# EAGLE design 1DD-17-test-board-mk-1.1 (EAGLE 6.6.0)
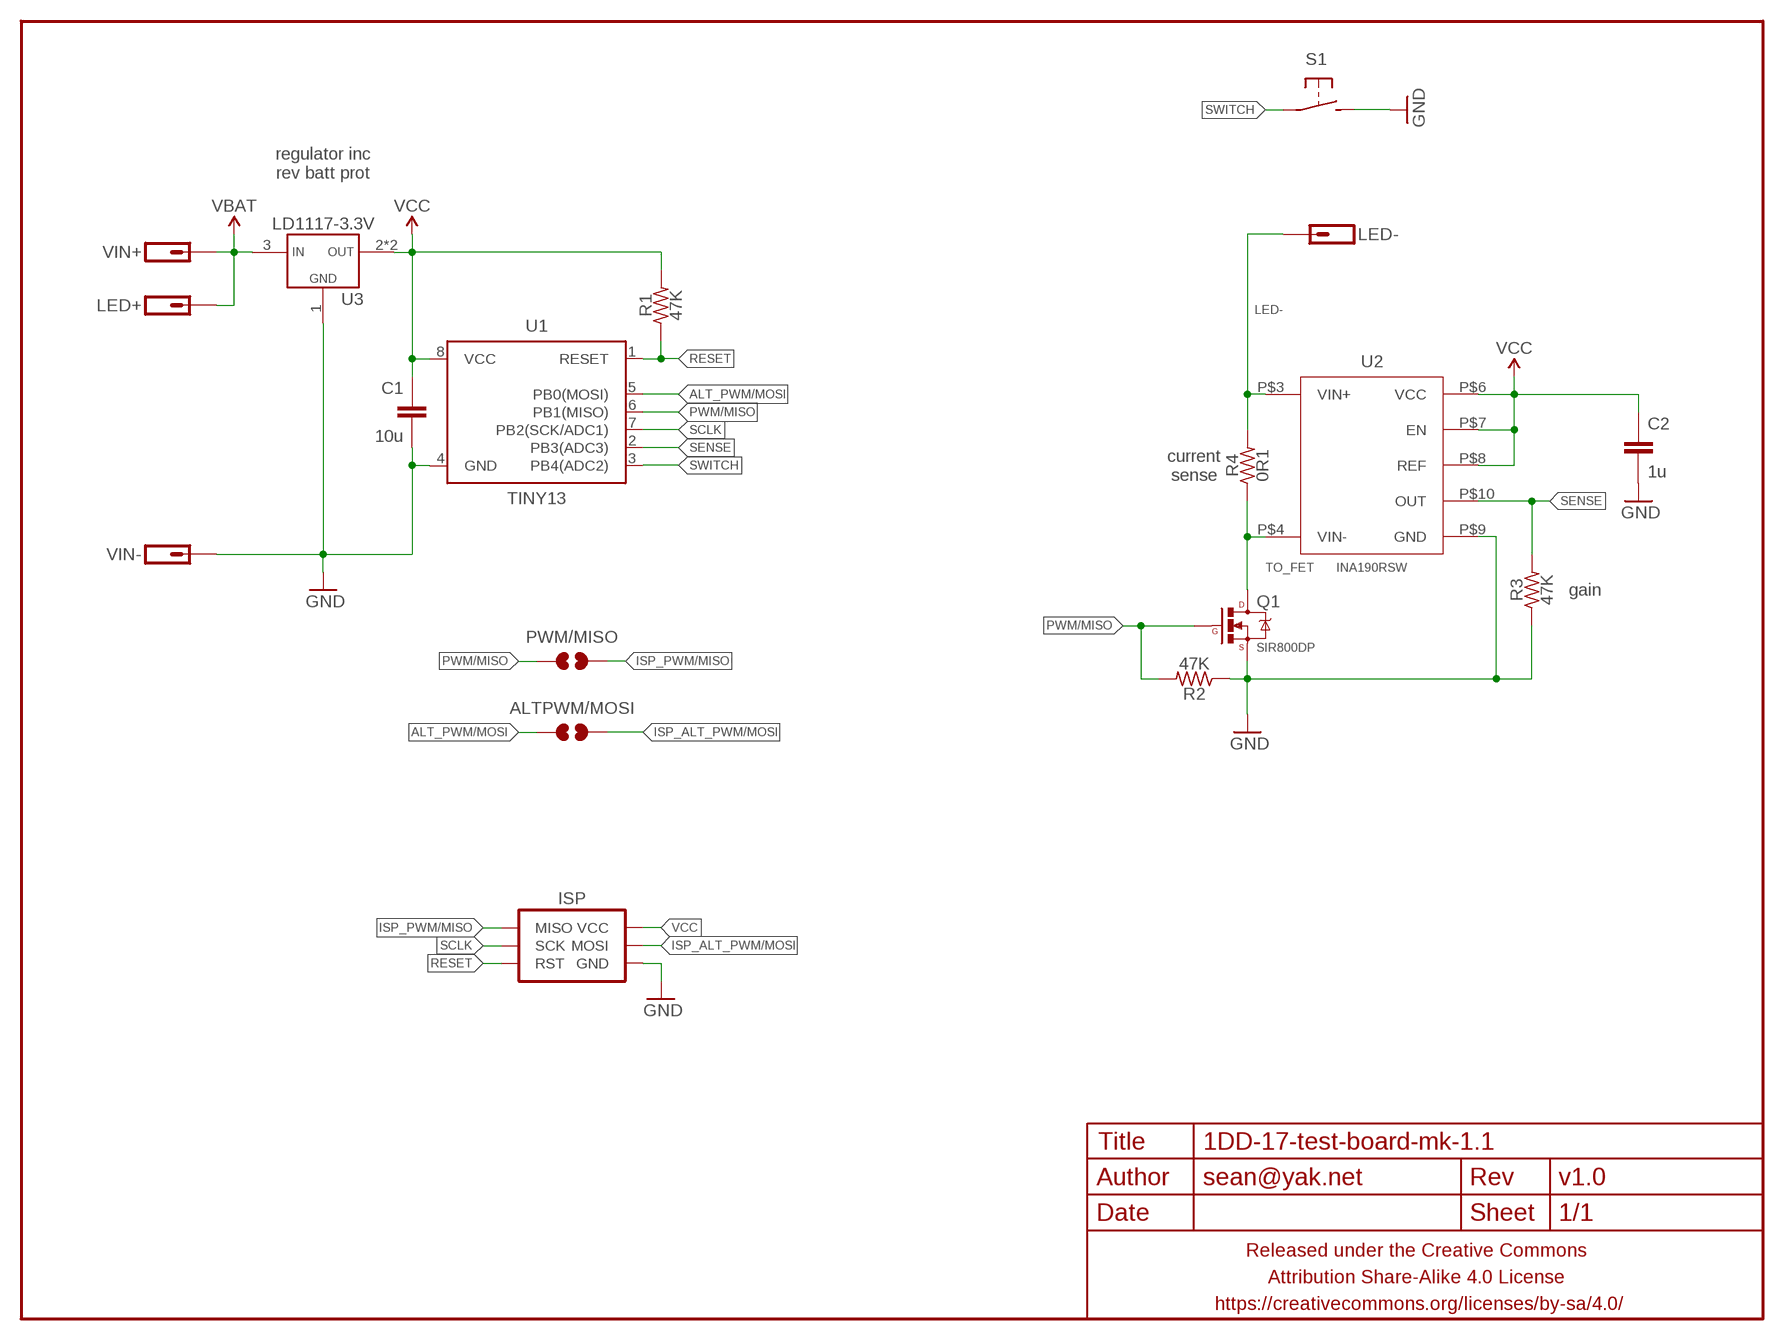
[diagram p0: schematic, sheet 1]

## Parts
ALTPWM/MOSI  JUMPER-PAD-2-NOYES_SILK  [PAD-JUMPER-2-NO_YES_SILK]
C1  10u  CAPACITOR-CERAMICC0805-TIGHTER  [C0805-TIGHTER]
C2  1u  CAPACITOR-CERAMICC0603-TIGHTER  [C0603-TIGHTER]
FRAME1  FRAME-LETTERNO_PACKAGE  [DUMMY]
ISP  AVR_SPI_PRG_6PTH  [2X3]
LED+  M01OFFSET  [1X01_OFFSET]
LED-  M01OFFSET  [1X01_OFFSET]
PWM/MISO  JUMPER-PAD-2-NOYES_SILK  [PAD-JUMPER-2-NO_YES_SILK]
Q1  SIR800DP  MOSFET-NCHANNELPSMN4R0-30YLD  [LFPAK56]
R1  47K  RESISTORR0603-TIGHTER  [R0603-TIGHTER]
R2  47K  RESISTORR0603-TIGHTER  [R0603-TIGHTER]
R3  47K  RESISTORR0603-TIGHTER  [R0603-TIGHTER]
R4  0R1  RESISTORR1206  [R1206]
S1  SPST-NO-TACT3MM-PTH-SMALL-PADS  [DTS-3-SMALL-PADS]
U1  TINY13  ATTINY13SOIC-NARROWER  [SO08-SKINNYPADS]
U2  INA190RSW  [UQFN-10]
U3  LD1117-3.3V  VREG_1117SOT223  [SOT223]
VIN+  M01OFFSET  [1X01_OFFSET]
VIN-  M01OFFSET  [1X01_OFFSET]

## Nets
ALT_PWM/MOSI: ALTPWM/MOSI.1 U1.5(PB0(MOSI))
GND: C1.2 C2.2 ISP.6(GND) Q1.1(S) Q1.2(S) Q1.3(S) R2.1 R3.1 S1.2 U1.4(GND) U3.1(GND) VIN-.1
ISP_ALT_PWM/MOSI: ALTPWM/MOSI.2 ISP.4(MOSI)
ISP_PWM/MISO: ISP.1(MISO) PWM/MISO.2
LED-: LED-.1 R4.2 U2.P$3(VIN+)
PWM/MISO: PWM/MISO.1 Q1.4(G) R2.2 U1.6(PB1(MISO))
RESET: ISP.5(RST) R1.1 U1.1(RESET)
SCLK: ISP.3(SCK) U1.7(PB2(SCK/ADC1))
SENSE: R3.2 U1.2(PB3(ADC3))
SWITCH: S1.1 U1.3(PB4(ADC2))
TO_FET: Q1.MB@1(D) Q1.MB@2(D) R4.1 U2.P$4(VIN-)
VBAT: LED+.1 U3.3(VIN) VIN+.1
VCC: C1.1 C2.1 ISP.2(VCC) R1.2 U1.8(VCC) U2.P$7(EN) U2.P$8(REF) U3.2(VOUT) U3.4(VOUT)
Unconnected: U2.P$6(VCC) U2.P$9(GND) U2.P$10(OUT)

## Notes on the sheet
- regulator inc
  rev batt prot
- current
  sense
- gain

## Library data of the parts
ALTPWM/MOSI PWM/MISO = a_parts:JUMPER-PAD-2-NO
C1 C2 = a_parts:CAPACITOR-CERAMIC: CAPACITOR, European symbol
FRAME1 = a_parts:FRAME-LETTER: Schematic Frame Standard 8.5x11 US Letter frame; DESIGNER: sean@yak.net; VERSION: v1.0
ISP = a_parts:AVR_SPI_PRG_6: AVR ISP 6 Pin This is the reduced ISP connector for AVR programming. Common on Arduino. This footprint will take up less PCB space and can be used with a 10-pin to 6-pin adapter such as SKU: BOB-08508 **Special note about "TEST_POINT" package. The stop mask is on the top side, so if you want your programming test points to be on the bottom of your board, make sure to place this package on the bottom side of the board. This also ensure that the orientation to program from the bottom side will be correct.
LED+ LED- VIN+ VIN- = a_parts:M01: Header 1 Standard 1-pin 0.1" header. Use with straight break away headers (SKU : PRT-00116), right angle break away headers (PRT-00553), swiss pins (PRT-00743), machine pins (PRT-00117), and female headers (PRT-00115).
Q1 = a_parts:MOSFET-NCHANNEL: Common NMOSFET Parts MFG P/N Store ID Prod ID FDD8780 TRANS-09984 SI7820DN TRANS-11055 FDS6630A IC-08089 2N7002PW TRANS-11151 FQP30N06L COM-10213 TRANS-10060 BSS123LT1G TRANS-08345 BSS138 TRANS-00830 BS170 2N7000
R1-R4 = a_parts:RESISTOR: RESISTOR, American symbol
S1 = a_parts:SPST-NO-TACT
U1 = a_parts:ATTINY13: Atmel 8-pin 1kB flash uC
U2 = a_parts:INA190
U3 = a_parts:VREG_1117

## Board
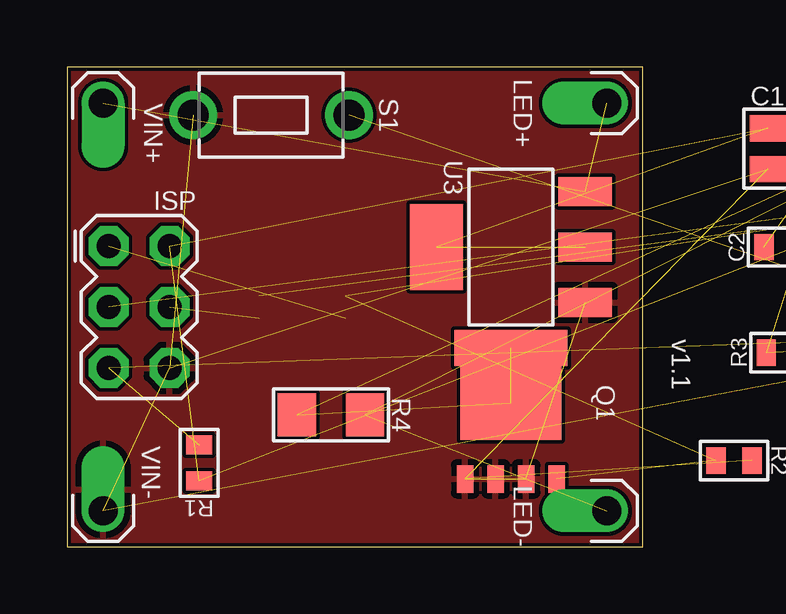
[diagram p1: board, top side]
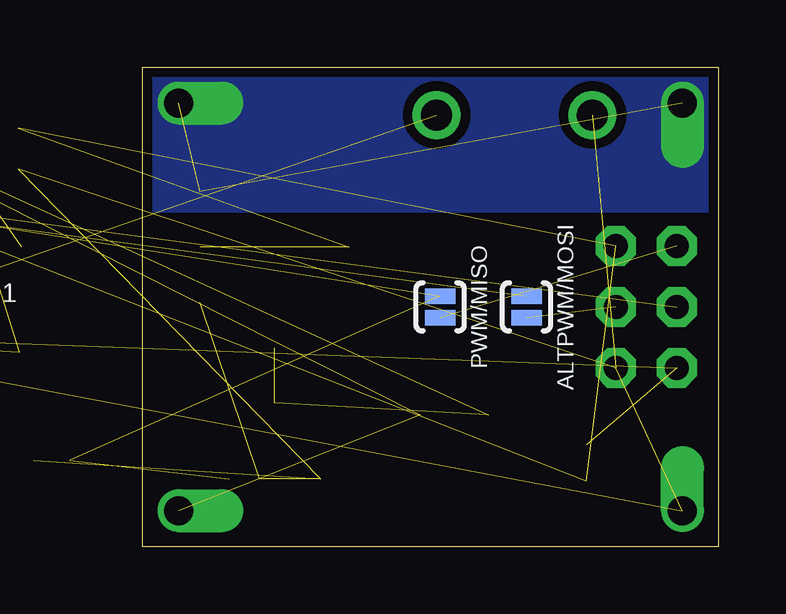
[diagram p2: board, bottom side, seen from below]

Size 24 x 20 mm. Coordinates in mm from the lower left corner, seen from the top.
Outline: 0,0 24,0 24,20 0,20 0,0
Copper layers (1*16): Top 0.0356mm / dielectric 1.5011mm / Bottom 0.0356mm
Design rules "LaenPCBOrder2 *": minimum track width 6mil, minimum drill 13mil, track to track 6mil, track to pad 6mil, pad to pad 6mil, via to via 6mil, smd to smd 6mil, copper to edge 6mil, drill to drill 6mil, minimum pad ring 7mil, minimum via ring 7mil, stop-mask expansion 3mil, vias tented up to drill 20mil, thermal gap 10mil

### Footprints (pad centres in the part's own frame; a part is rotated, then mirrored left to right if it is on the bottom)
PAD-JUMPER-2-NO_YES_SILK = smd 0.635 x 1.27: 1 -0.45,0; 2 0.45,0
C0805-TIGHTER = smd 1.1 x 1.5: 1 -0.85,0; 2 0.85,0
C0603-TIGHTER = smd 0.8 x 1.1: 1 -0.75,0; 2 0.75,0
2X3 = drill 1 pad 1.676 octagon: 1 -2.54,-1.27; 2 -2.54,1.27; 3 0,-1.27; 4 0,1.27; 5 2.54,-1.27; 6 2.54,1.27
1X01_OFFSET = drill 1.2 pad 1.778 offset: 1 0,0
LFPAK56 = smd 0.7 x 1.15: 1 -1.905,-3.175; 2 -0.635,-3.175; 3 0.635,-3.175; 4 1.905,-3.175 | smd 4.2 x 3.1: MB@1 0,0 | smd 4.7 x 1.5: MB@2 0,2.3
R0603-TIGHTER = smd 0.8 x 1.1: 1 -0.75,0; 2 0.75,0
R1206 = smd 1.6 x 1.8: 1 -1.42,0; 2 1.42,0
DTS-3-SMALL-PADS = drill 1.3 pad 2: 1 -3.25,0; 2 3.25,0
SO08-SKINNYPADS = smd 0.66 x 1.524: 1 -1.905,-2.973; 2 -0.635,-2.973; 3 0.635,-2.973; 4 1.905,-2.973; 5 1.905,2.973; 6 0.635,2.973; 7 -0.635,2.973; 8 -1.905,2.973
UQFN-10 = smd 0.2 x 0.8: P$1 -0.2,-0.7; P$2 0.2,-0.7; P$6 0.2,0.7; P$7 -0.2,0.7 | smd 0.8 x 0.2: P$3 0.9,-0.3; P$4 0.9,0; P$5 0.9,0.3; P$8 -0.9,0.3; P$9 -0.9,0; P$10 -0.9,-0.3
SOT223 = smd 1.219 x 2.235: 1 -2.311,-3.099; 2 0,-3.099; 3 2.311,-3.099 | smd 3.6 x 2.2: 4 0,3.099

### Placement (x,y rotation side)
ALTPWM/MOSI  8,10 270 bottom
C1  29.2,16.6 270 top  (outside the outline)
C2  29.8,12.5 0 top  (outside the outline)
FRAME1  0,0 0 top
ISP  3,10 270 top
LED+  22.5,18.5 90 top
LED-  22.5,1.5 90 top
PWM/MISO  11.6,10 270 bottom
Q1  18.5,6 0 top
R1  5.5,3.5 270 top
R2  27.8,3.6 180 top  (outside the outline)
R3  29.9,8.1 0 top  (outside the outline)
R4  11,5.5 0 top
S1  8.5,18 180 top
U1  37.8,11.7 0 top  (outside the outline)
U2  33.1,16.7 0 top  (outside the outline)
U3  18.5,12.5 90 top
VIN+  1.5,18.5 180 top
VIN-  1.5,1.5 0 top

### Tracks (layer width: path | path; a pad name or v marks a point on that pad's centre or on a via)
ALT_PWM/MOSI  (1 unrouted)
GND  (11 unrouted)
  pour Top (isolate 0.152, rank 6): 24,0 24,20 0,20 0,0
ISP_ALT_PWM/MOSI  (1 unrouted)
ISP_PWM/MISO  (1 unrouted)
LED-  (2 unrouted)
PWM/MISO  (3 unrouted)
RESET  (2 unrouted)
SCLK  (1 unrouted)
SENSE  (1 unrouted)
SWITCH  (1 unrouted)
TO_FET  (3 unrouted)
VBAT  (2 unrouted)
  pour Bottom (isolate 0.406, no thermals): 0,20 24,20 24,14 0,14
VCC  (8 unrouted)

### Text on the board
tPlace: 1DD-17 Test